# EAGLE design aparture_v1_controller (EAGLE 6.3)
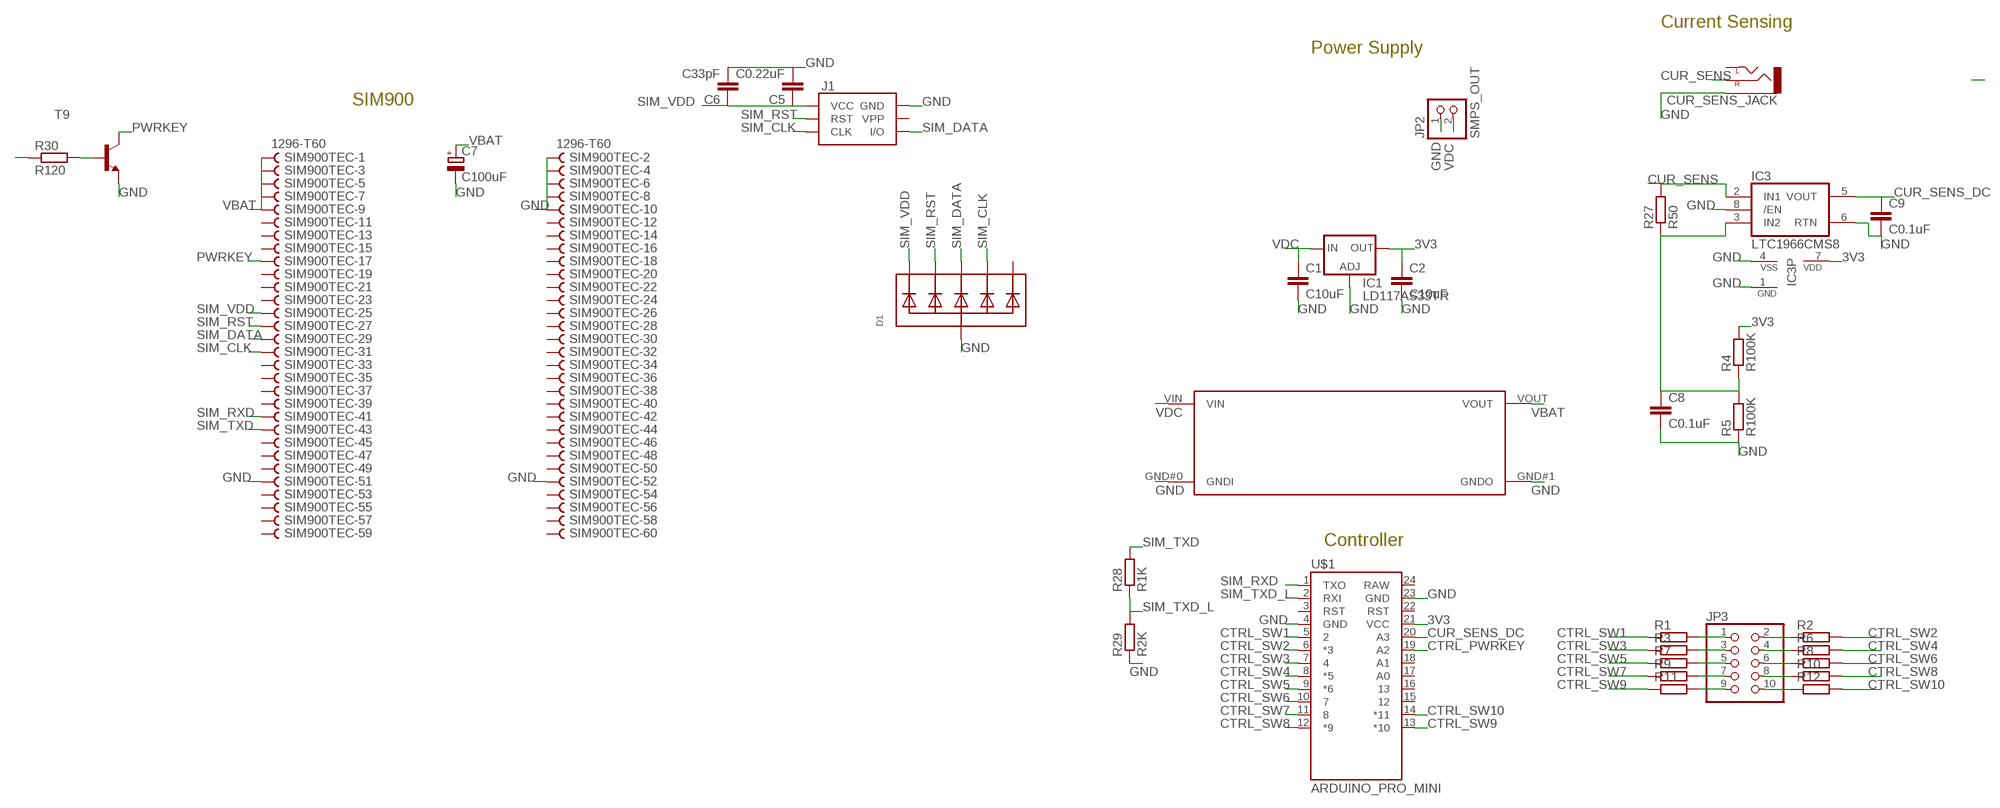
[diagram p0: schematic, sheet 1]

## Parts
C1  C10uF  C-EUC0805  [C0805]
C2  C10uF  C-EUC0805  [C0805]
C5  C0.22uF  C-EUC0805  [C0805]
C6  C33pF  C-EUC0805  [C0805]
C7  C100uF  CPOL-EU153CLV-0605  [153CLV-0605]
C8  C0.1uF  C-EUC0805  [C0805]
C9  C0.1uF  C-EUC0805  [C0805]
CUR_SENS_JACK  AUDIO-JACKSMD2  [AUDIO-JACK-3.5MM-SMD]
D1  TVSARRAY_5LANE  [SOT363]
IC1  LD117AS33TR  [SOT223]
IC3  LTC1966CMS8  [MSOP8]
J1  SIMHOLDERSIM  [SIMHOLDER]
JP2  SMPS_OUT  PINHD-1X2  [1X02]
JP3  PINHD-2X5  [2X05]
R1  R-EU_R0603  [R0603]
R2  R-EU_R0603  [R0603]
R3  R-EU_R0603  [R0603]
R4  R100K  R-EU_M0805  [M0805]
R5  R100K  R-EU_M0805  [M0805]
R6  R-EU_R0603  [R0603]
R7  R-EU_R0603  [R0603]
R8  R-EU_R0603  [R0603]
R9  R-EU_R0603  [R0603]
R10  R-EU_R0603  [R0603]
R11  R-EU_R0603  [R0603]
R12  R-EU_R0603  [R0603]
R27  R50  R-EU_M0805  [M0805]
R28  R1K  R-EU_M0805  [M0805]
R29  R2K  R-EU_M0805  [M0805]
R30  R120  R-EU_M0805  [M0805]
SIM900TEC  1296-T60  [1296-60]
T9  MMBT2222ALT1-NPN-SOT23-BEC  [SOT23-BEC]
U$1  ARDUINO_PRO_MINI  [ARDUINO_PRO_MINI]
VOL_REG_SIM900  DCDCMODULE  [DCDCMODULE]

## Nets
3V3: C2.1 IC1.4(OUT) IC3.7(VDD) R4.2 U$1.21(VCC)
CTRL_PWRKEY: R30.1 U$1.19(A2)
CTRL_SW1: R1.1 U$1.5
CTRL_SW2: R2.2 U$1.6(*3)
CTRL_SW3: R3.1 U$1.7
CTRL_SW4: R6.2 U$1.8(*5)
CTRL_SW5: R7.1 U$1.9(*6)
CTRL_SW6: R8.2 U$1.10
CTRL_SW7: R9.1 U$1.11
CTRL_SW8: R10.2 U$1.12(*9)
CTRL_SW9: R11.1 U$1.13(*10)
CTRL_SW10: R12.2 U$1.14(*11)
CUR_SENS: CUR_SENS_JACK.RING(RIGHT) IC3.2(IN1) R27.2
CUR_SENS_DC: C9.1 IC3.5(VOUT) U$1.20(A3)
GND: C1.2 C2.2 C5.2 C6.2 C7.- C8.2 C9.2 CUR_SENS_JACK.SLEEVE D1.2(A) IC1.1(ADJ) IC3.1(GND) IC3.4(VSS) IC3.6(RTN) IC3.8(/EN) J1.C5(GND) JP2.1 R5.1 R29.1 SIM900TEC.2 SIM900TEC.4 SIM900TEC.6 SIM900TEC.8 SIM900TEC.10 SIM900TEC.51 SIM900TEC.52 T9.E U$1.4(GND) U$1.23(GND) VOL_REG_SIM900.GND#0(GNDI) VOL_REG_SIM900.GND#1(GNDO)
N$1: JP3.1 R1.2
N$2: JP3.3 R3.2
N$3: JP3.5 R7.2
N$4: JP3.7 R9.2
N$5: JP3.9 R11.2
N$6: JP3.2 R2.1
N$7: C8.1 IC3.3(IN2) R4.1 R5.2 R27.1
N$8: R30.2 T9.B
N$9: JP3.4 R6.1
N$10: JP3.6 R8.1
N$11: JP3.8 R10.1
N$12: JP3.10 R12.1
PWRKEY: SIM900TEC.17 T9.C
SIM_CLK: D1.5(C4) J1.C3(CLK) SIM900TEC.31
SIM_DATA: D1.4(C3) J1.C7(I/O) SIM900TEC.29
SIM_RST: D1.3(C2) J1.C2(RST) SIM900TEC.27
SIM_RXD: SIM900TEC.41 U$1.1(TXO)
SIM_TXD: R28.2 SIM900TEC.43
SIM_TXD_L: R28.1 R29.2 U$1.2(RXI)
SIM_VDD: C5.1 C6.1 D1.1(C1) J1.C1(VCC) SIM900TEC.25
VBAT: C7.+ SIM900TEC.1 SIM900TEC.3 SIM900TEC.5 SIM900TEC.7 SIM900TEC.9 VOL_REG_SIM900.VOUT
VDC: C1.1 IC1.3(IN) JP2.2 VOL_REG_SIM900.VIN
Unconnected: CUR_SENS_JACK.TIP(LEFT) D1.6(C5) J1.C6(VPP) SIM900TEC.11 SIM900TEC.12 SIM900TEC.13 SIM900TEC.14 SIM900TEC.15 SIM900TEC.16 SIM900TEC.18 SIM900TEC.19 SIM900TEC.20 SIM900TEC.21 SIM900TEC.22 SIM900TEC.23 SIM900TEC.24 SIM900TEC.26 SIM900TEC.28 SIM900TEC.30 SIM900TEC.32 SIM900TEC.33 SIM900TEC.34 SIM900TEC.35 SIM900TEC.36 SIM900TEC.37 SIM900TEC.38 SIM900TEC.39 SIM900TEC.40 SIM900TEC.42 SIM900TEC.44 SIM900TEC.45 SIM900TEC.46 SIM900TEC.47 SIM900TEC.48 SIM900TEC.49 SIM900TEC.50 SIM900TEC.53 SIM900TEC.54 SIM900TEC.55 SIM900TEC.56 SIM900TEC.57 SIM900TEC.58 SIM900TEC.59 SIM900TEC.60 U$1.3(RST) U$1.15 U$1.16 U$1.17(A0) U$1.18(A1) U$1.22(RST) U$1.24(RAW)

## Notes on the sheet
- Current Sensing
- Power Supply
- SIM900
- Controller

## Library data of the parts
C1 C2 C5 C6 C8 C9 = resistor:C-EU: CAPACITOR, European symbol
C7 = resistor:CPOL-EU: POLARIZED CAPACITOR, European symbol
CUR_SENS_JACK = SparkFun-Connectors:AUDIO-JACK: 3.5mm Audio Jack Simple 3.5mm common PCB mount audio jack. SKU: PRT-08032; PROD_ID: CONN-10353
D1 = microbuilder:TVSARRAY_5LANE: Voltage Transient Suppressor Array SOT363 SMF05C - 100W 5V: Digikey - SMF05CT1GOSCT-ND
IC1 = v-reg:LD117A?*: Low drop fixed and adjustable positive voltage regulators 1 A Source: http://www.st.com/stonline/products/literature/ds/7194/ld1117axx.pdf
IC3 = linear-technology-2:LTC1966*: Precision Micropower, DS RMS-to-DC Converter
J1 = SparkFun-Connectors:SIMHOLDER: SIM Socket Socket for SIM cellular cards. Schematic element and footprint production proven. Spark Fun Electronics SKU : PRT-00548; PROD_ID: CONN-08536
JP2 = pinhead:PINHD-1X2: PIN HEADER
JP3 = pinhead:PINHD-2X5: PIN HEADER
R1-R3 R6-R12 = rcl:R-EU_: RESISTOR, European symbol
R4 R5 R27-R30 = resistor:R-EU_: RESISTOR, European symbol
SIM900TEC = con-leotronics:1296-T60: 1.27mm SINGLE ROW FEMALE SOCKET Source: http://www.leotronics.co.uk/Conexcon/Data%20Sheets/sec.%20A/1296ing.pdf; OC_FARNELL: unknown; OC_NEWARK: unknown
T9 = transistor-neu-to92:*-NPN-: NPN Transistror
U$1 = tigorcustom:ARDUINO_PRO_MINI
VOL_REG_SIM900 = bontor:DCDCMODULE

## Board
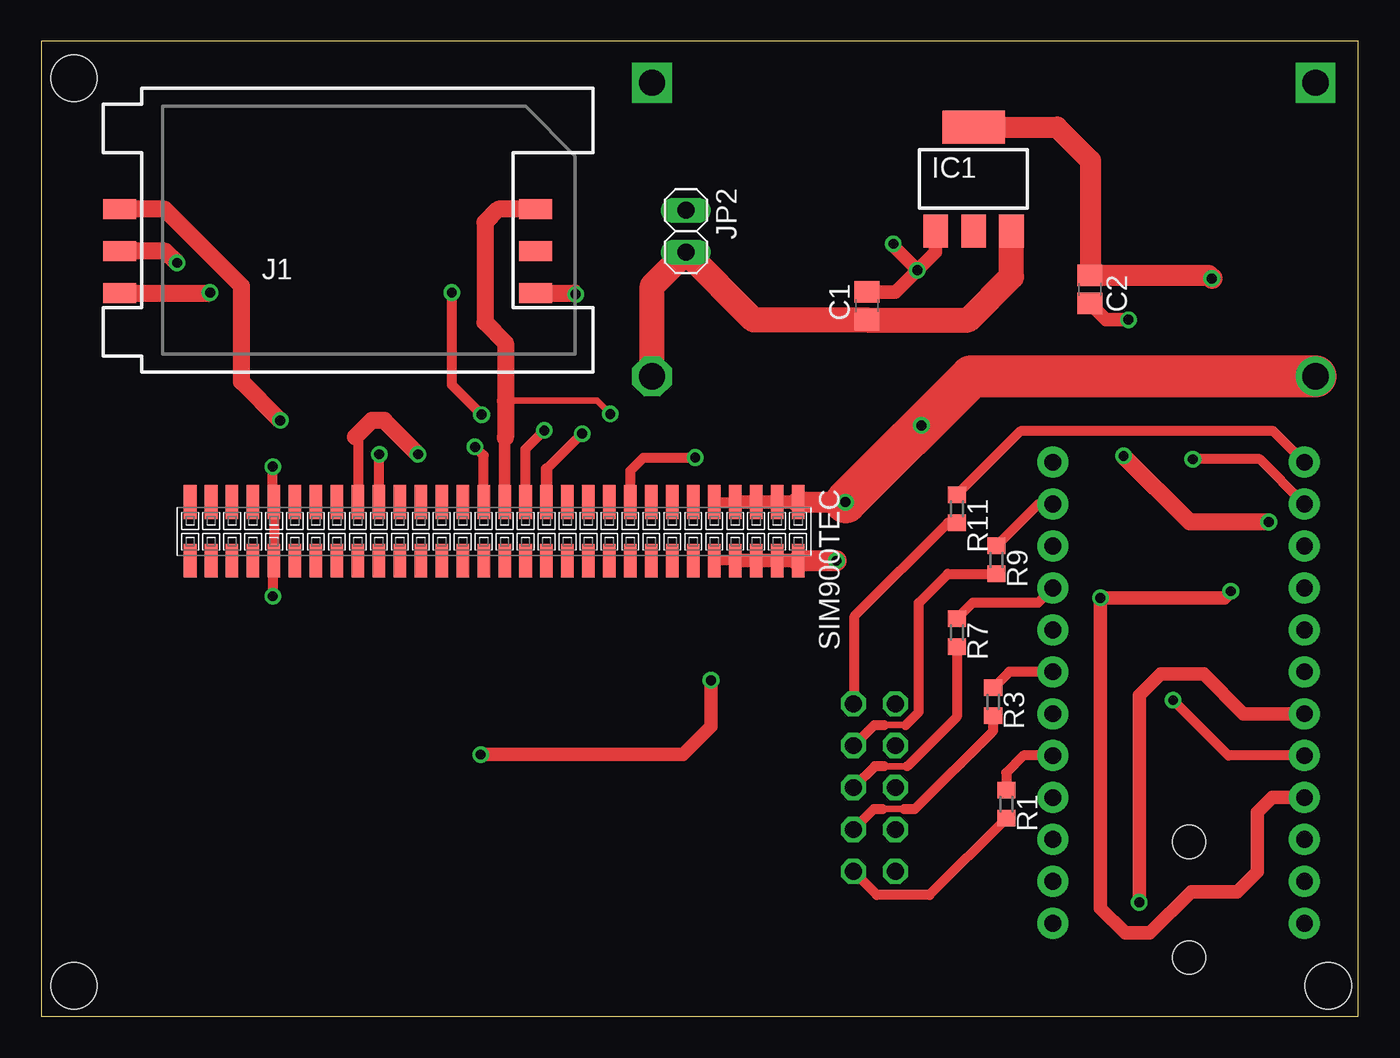
[diagram p1: board, top side]
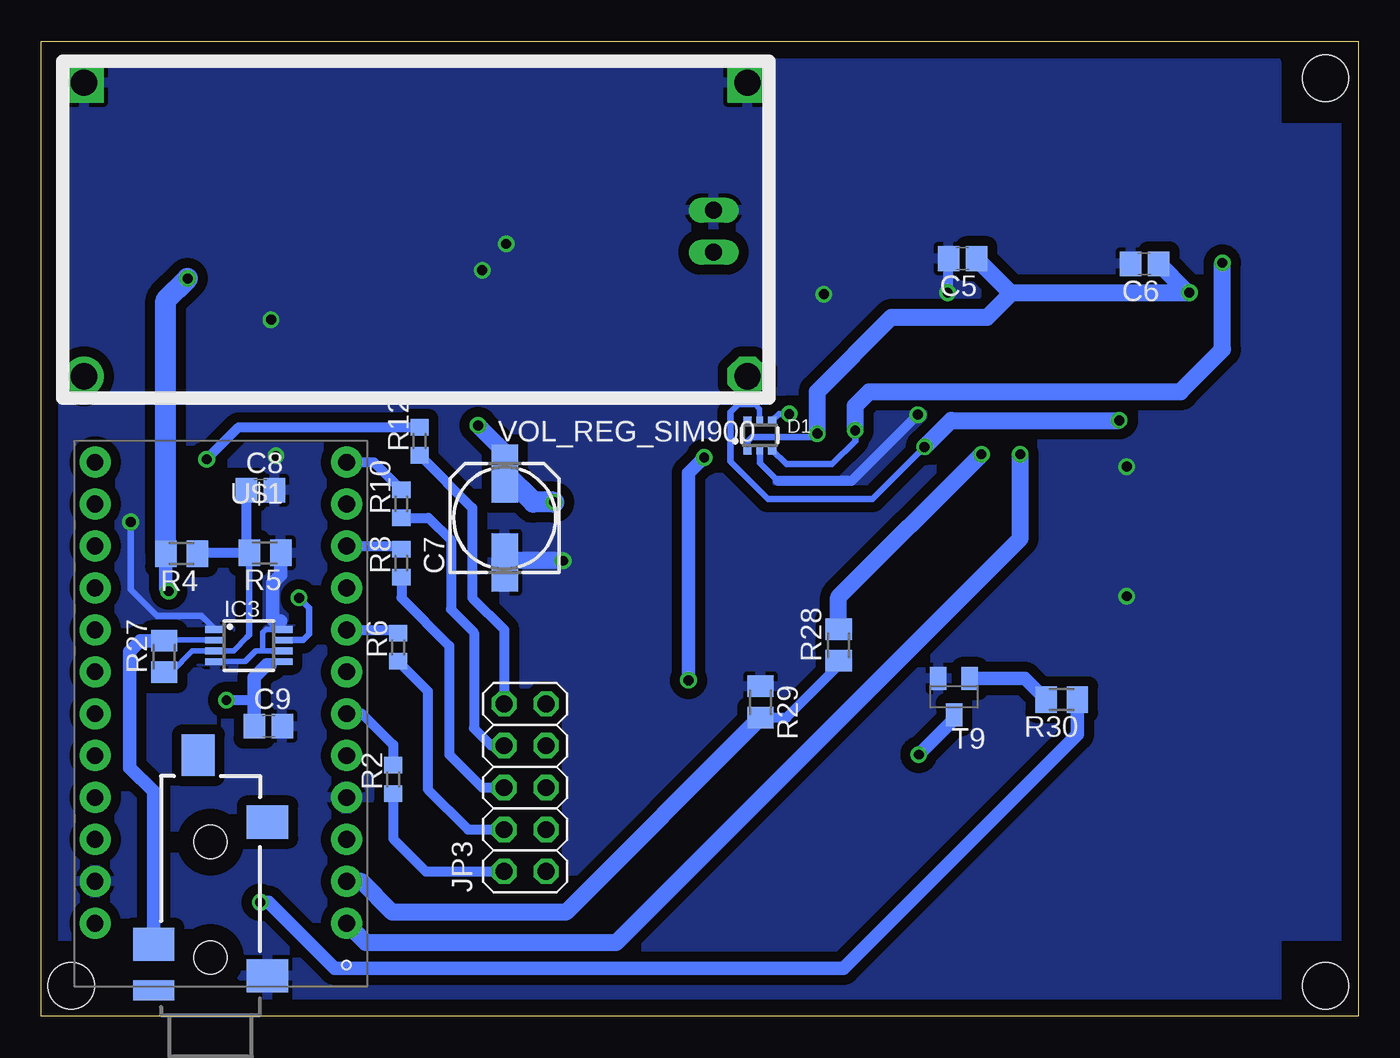
[diagram p2: board, bottom side, seen from below]

Size 79.8 x 59.1 mm. Coordinates in mm from the lower left corner, seen from the top.
Outline: 0,0 79.8,0 79.8,59.1 0,59.1 0,0
Copper layers (1*16): Top 0.035mm / dielectric 1.5mm / Bottom 0.035mm
Design rules "default": minimum track width 10mil, minimum drill 24mil, track to track 8mil, track to pad 8mil, pad to pad 8mil, via to via 8mil, smd to smd 8mil, copper to edge 40mil, drill to drill 8mil, minimum pad ring 10mil, minimum via ring 8mil, stop-mask expansion 4mil, vias tented up to drill 0mil, thermal gap 10mil
Holes 2.8 mm at 1.98,56.87 1.98,1.87 77.98,1.87

### Footprints (pad centres in the part's own frame; a part is rotated, then mirrored left to right if it is on the bottom)
C0805 = smd 1.3 x 1.5: 1 -0.85,0; 2 0.85,0
153CLV-0605 = smd 3.5 x 1.6: + 2.7,0; - -2.7,0
AUDIO-JACK-3.5MM-SMD = smd 2 x 2.5: RING 4.3,3.45; SLEEVE 2.4,-3.45; TIP 11.7,-3.45 | smd 1.2 x 2.5: RSH 1.5,3.45 | smd 2.5 x 2: TSH 15.75,0.75 | hole 2: 3.5,0; 10.5,0
SOT363 = smd 0.5 x 0.5: 1 -0.75,-0.9; 3 0.75,-0.9; 4 0.75,0.9; 6 -0.75,0.9 | smd 0.4 x 0.5: 2 0,-0.9; 5 0,0.9
SOT223 = smd 1.5 x 2: 1 -2.3,-3.15; 2 0,-3.15; 3 2.3,-3.15 | smd 3.8 x 2: 4 0,3.15
MSOP8 = smd 0.4 x 1.2: 1 -0.975,-2.05; 2 -0.325,-2.05; 3 0.325,-2.05; 4 0.975,-2.05; 5 0.975,2.05; 6 0.325,2.05; 7 -0.325,2.05; 8 -0.975,2.05
SIMHOLDER = smd 2 x 1.2: C1 -12.61,-3.81; C2 -12.61,-1.27; C3 -12.61,1.27; C5 12.61,-3.81; C6 12.61,-1.27; C7 12.61,1.27
1X02 = drill 1.016 long: 1 -1.27,0; 2 1.27,0
2X05 = drill 1.016 octagon: 1 -5.08,-1.27; 2 -5.08,1.27; 3 -2.54,-1.27; 4 -2.54,1.27; 5 0,-1.27; 6 0,1.27; 7 2.54,-1.27; 8 2.54,1.27; 9 5.08,-1.27; 10 5.08,1.27
R0603 = smd 1 x 1.1: 1 -0.85,0; 2 0.85,0
M0805 = smd 1.3 x 1.6: 1 -0.95,0; 2 0.95,0
1296-60 = smd 0.76 x 2.05: 1 -18.415,-1.78; 2 -18.415,1.78; 3 -17.145,-1.78; 4 -17.145,1.78; 5 -15.875,-1.78; 6 -15.875,1.78; 7 -14.605,-1.78; 8 -14.605,1.78; 9 -13.335,-1.78; 10 -13.335,1.78; 11 -12.065,-1.78; 12 -12.065,1.78; 13 -10.795,-1.78; 14 -10.795,1.78; 15 -9.525,-1.78; 16 -9.525,1.78; 17 -8.255,-1.78; 18 -8.255,1.78; 19 -6.985,-1.78; 20 -6.985,1.78; 21 -5.715,-1.78; 22 -5.715,1.78; 23 -4.445,-1.78; 24 -4.445,1.78; 25 -3.175,-1.78; 26 -3.175,1.78; 27 -1.905,-1.78; 28 -1.905,1.78; 29 -0.635,-1.78; 30 -0.635,1.78; 31 0.635,-1.78; 32 0.635,1.78; 33 1.905,-1.78; 34 1.905,1.78; 35 3.175,-1.78; 36 3.175,1.78; 37 4.445,-1.78; 38 4.445,1.78; 39 5.715,-1.78; 40 5.715,1.78; 41 6.985,-1.78; 42 6.985,1.78; 43 8.255,-1.78; 44 8.255,1.78; 45 9.525,-1.78; 46 9.525,1.78; 47 10.795,-1.78; 48 10.795,1.78; 49 12.065,-1.78; 50 12.065,1.78; 51 13.335,-1.78; 52 13.335,1.78; 53 14.605,-1.78; 54 14.605,1.78; 55 15.875,-1.78; 56 15.875,1.78; 57 17.145,-1.78; 58 17.145,1.78; 59 18.415,-1.78; 60 18.415,1.78
SOT23-BEC = smd 1 x 1.4: B -0.95,-1.1; C 0,1.1; E 0.95,-1.1
ARDUINO_PRO_MINI = drill 1.016 pad 1.88: 1 -7.62,12.7; 2 -7.62,10.16; 3 -7.62,7.62; 4 -7.62,5.08; 5 -7.62,2.54; 6 -7.62,0; 7 -7.62,-2.54; 8 -7.62,-5.08; 9 -7.62,-7.62; 10 -7.62,-10.16; 11 -7.62,-12.7; 12 -7.62,-15.24; 13 7.62,-15.24; 14 7.62,-12.7; 15 7.62,-10.16; 16 7.62,-7.62; 17 7.62,-5.08; 18 7.62,-2.54; 19 7.62,0; 20 7.62,2.54; 21 7.62,5.08; 22 7.62,7.62; 23 7.62,10.16; 24 7.62,12.7
DCDCMODULE = drill 1.6 square: GND#0 1.7,1.7; GND#1 41.9,1.7 | drill 1.6 octagon: VIN 1.7,19.5 | drill 1.6: VOUT 41.9,19.5

### Placement (x,y rotation side)
C1  50.03,43.06 90 top
C2  63.53,44.06 270 top
C5  23.98,45.92 180 bottom
C6  12.94,45.61 180 bottom
C7  51.72,30.21 90 bottom
C8  66.52,31.89 0 bottom
C9  66.04,17.59 0 bottom
CUR_SENS_JACK  69.54,0.08 90 bottom
D1  36.26,35.22 0 bottom
IC1  56.49,50.75 0 top
IC3  67.22,22.48 270 bottom
J1  17.35,47.65 0 top
JP2  39.06,47.59 270 top
JP3  50.48,13.87 90 bottom
R1  58.48,12.87 270 top
R2  58.48,14.37 90 bottom
R3  57.68,19.07 270 top
R4  71.3,28.05 180 bottom
R5  66.24,28.1 180 bottom
R6  58.18,22.37 90 bottom
R7  55.48,23.27 270 top
R8  57.98,27.47 90 bottom
R9  57.88,27.67 270 top
R10  57.98,31.07 90 bottom
R11  55.48,30.77 270 top
R12  56.88,34.87 90 bottom
R27  72.35,21.81 90 bottom
R28  31.49,22.51 90 bottom
R29  36.22,19.06 270 bottom
R30  17.97,19.21 180 bottom
SIM900TEC  27.44,29.4 180 top
T9  24.49,19.38 180 bottom
U$1  68.92,18.35 180 bottom
VOL_REG_SIM900  35.31,58.29 180 bottom

### Tracks (layer width: path | path; a pad name or v marks a point on that pad's centre or on a via)
3V3  (via drill 0.6)
  Top 0.813: U$1.21 74.58,13.27 73.68,12.37 73.68,8.77 72.48,7.57 69.68,7.57 67.18,5.07 65.68,5.07 64.18,6.57 v64.18,25.37 71.68,25.37 v72.08,25.77
  Top 1.27: v70.93,44.72 70.74,44.91 C2.1 63.58,44.96 63.58,51.87 61.55,53.9 IC1.4
  Bottom 0.406: IC3.7 63.95,22.8 63.58,23.17 63.58,24.77 v64.18,25.37
  Bottom 0.813: v72.08,25.77 72.25,25.94 R4.2
  Bottom 1.27: R4.2 72.25,43.4 v70.93,44.72
CTRL_PWRKEY  (via drill 0.6)
  Top 0.813: v66.53,6.92 66.53,19.47 67.83,20.77 70.43,20.77 72.85,18.35 U$1.19
  Bottom 0.813: R30.1 17.02,17.08 31.18,2.92 62.03,2.92 66.03,6.92 v66.53,6.92
CTRL_SW1
  Top 0.61: U$1.5 59.52,15.81 58.48,14.77 R1.1
CTRL_SW2
  Bottom 0.61: U$1.6 60.36,18.35 58.48,16.47 R2.2
CTRL_SW3
  Top 0.61: U$1.7 58.65,20.89 R3.1
CTRL_SW4
  Bottom 0.61: U$1.8 58.39,23.43 R6.2
CTRL_SW5
  Top 0.61: U$1.9 60.4,25.07 56.43,25.07 R7.1
CTRL_SW6
  Bottom 0.61: U$1.10 58.17,28.51 R8.2
CTRL_SW7
  Top 0.61: U$1.11 60.41,31.05 R9.1
CTRL_SW8
  Bottom 0.61: U$1.12 59.65,33.59 R10.2
CTRL_SW9
  Top 0.61: U$1.13 74.66,35.47 59.33,35.47 R11.1
CTRL_SW10  (via drill 0.6)
  Top 0.61: U$1.14 73.82,33.77 v69.78,33.77
  Bottom 0.61: v69.78,33.77 67.83,35.72 R12.2
CUR_SENS
  Bottom 0.34: IC3.2 69.29,22.82 72.29,22.82 R27.2
  Bottom 0.813: R27.2 73.79,22.76 74.43,22.12 74.43,15.07 72.99,13.63 CUR_SENS_JACK.RING
CUR_SENS_DC  (via drill 0.6)
  Top 0.61: U$1.20 71.94,15.81 v68.58,19.17
  Bottom 0.34: 65.93,21.32 65.75,21.51 IC3.5
  Bottom 0.61: v68.58,19.17 66.94,19.17 66.89,19.12
  Bottom 0.813: C9.1 66.89,19.12 66.89,20.56 66.13,21.32 65.93,21.32
GND  (via drill 0.6)
  Top 0.61: SIM900TEC.8 SIM900TEC.10 | v14.03,33.32 14.03,31.26 SIM900TEC.51 SIM900TEC.52 14.03,27.55 v14.03,25.47 | v26.68,36.47 24.88,38.27 v24.88,43.87
  Top 0.813: SIM900TEC.2 SIM900TEC.4 SIM900TEC.6 SIM900TEC.8 | IC1.1 54.19,46.33 v53.08,45.22 | C1.2 51.77,43.91 v53.08,45.22 | v51.63,46.82 51.63,46.67 v53.08,45.22 | v65.88,42.22 64.52,42.22 C2.2
  Top 1.016: J1.C5 32.31,43.84 v32.38,43.77 | v74.38,29.97 69.58,29.97 v65.58,33.97
  Top 1.27: SIM900TEC.2 v48.18,27.62
  Bottom 0.33: 65.28,23.97 65.17,23.86 IC3.8
  Bottom 0.34: IC3.4 67.45,21.51 66.8,22.16 66.38,22.16 | 66.38,22.16 IC3.6 | IC3.8 65.19,23.47 66.18,23.47 66.38,23.27 66.38,22.16
  Bottom 0.406: D1.2 36.26,33.55 35.18,32.47 | IC3.1 70.09,24.27 72.78,24.27 74.38,25.87 v74.38,29.97
  Bottom 0.61: 35.18,32.47 30.68,32.47 v26.68,36.47 | v24.88,43.87 24.83,43.92 C5.2
  Bottom 0.813: R5.1 65.29,26.76 65.78,26.27 65.78,24.07 65.68,23.97 65.28,23.97
  Bottom 1.016: v48.18,27.62 51.61,27.62 C7.-
  pour Bottom (isolate 0.61): 0.98,4.87 4.98,4.87 4.98,0.87 74.98,0.87 74.98,4.87 78.98,4.87 78.98,57.87 4.98,57.87 4.98,53.87 0.98,53.87
N$1
  Top 0.61: R1.2 53.83,7.37 50.63,7.37 JP3.1
N$2
  Top 0.406: 50.98,12.57 52.28,12.57
  Top 0.61: 50.98,12.57 50.45,12.57 JP3.3 | 52.28,12.57 52.93,12.57 57.68,17.32 R3.2
N$3
  Top 0.406: 52.48,15.17 51.08,15.17
  Top 0.61: R7.2 55.48,18.17 52.48,15.17 | 51.08,15.17 50.51,15.17 JP3.5
N$4
  Top 0.406: 51.08,17.67 52.38,17.67
  Top 0.61: JP3.7 50.47,17.67 51.08,17.67 | R9.2 54.93,26.82 53.18,25.07 53.18,18.47 52.38,17.67
N$5
  Top 0.61: R11.2 54.93,29.92 49.28,24.27 49.28,19.02 JP3.9
N$6
  Bottom 0.61: R2.1 58.48,10.77 56.5,8.79 JP3.2
N$7
  Bottom 0.34: R27.1 71.94,20.86 70.65,22.16 IC3.3 68.15,22.16 67.28,23.02
  Bottom 0.406: 67.28,23.02 67.19,23.11 R5.2
  Bottom 0.61: R4.1 70.3,28.1 R5.2 67.37,28.28 C8.1
N$8
  Bottom 0.813: R30.2 20.19,20.48 T9.B
N$9
  Bottom 0.61: R6.1 56.38,19.72 56.38,13.77 53.94,11.33 JP3.4
N$10
  Bottom 0.61: R8.1 57.98,25.37 55.08,22.47 55.08,15.87 53.08,13.87 JP3.6
N$11
  Bottom 0.61: R10.1 56.33,30.22 54.98,28.87 54.98,24.67 53.58,23.27 53.58,17.47 52.52,16.41 JP3.8
N$12
  Bottom 0.61: R12.1 53.68,30.82 53.68,25.37 51.75,23.44 JP3.10
PWRKEY  (via drill 0.6)
  Top 0.61: SIM900TEC.17 35.7,33.09 36.48,33.87 v39.63,33.87
  Top 0.813: v26.63,15.87 38.88,15.87 40.58,17.57 v40.58,20.37
  Bottom 0.813: v39.63,33.87 40.58,32.92 v40.58,20.37 | v26.63,15.87 24.49,18.01 T9.C
SIM_CLK  (via drill 0.6)
  Top 0.61: SIM900TEC.31 26.8,33.99 v26.28,34.52
  Top 1.016: v14.48,36.12 12.13,38.47 12.13,44.27 7.48,48.92 J1.C3
  Bottom 0.34: D1.5 36.28,36.14 36.28,36.82 36.53,37.07 37.58,37.07
  Bottom 0.406: 37.58,37.07 38.03,36.62 38.03,33.62 35.78,31.37 29.43,31.37 v26.28,34.52
  Bottom 1.016: v26.28,34.52 24.68,36.12 v14.48,36.12
SIM_DATA  (via drill 0.6)
  Top 0.406: v34.48,36.52 33.68,37.32 28.13,37.32
  Top 0.7: SIM900TEC.29 28.07,35.06 28.13,35.12
  Top 1.016: J1.C7 27.68,48.92 26.88,48.12 26.88,42.07 28.13,40.82 28.13,37.32 28.13,35.12 28.13,35.07
  Bottom 0.406: D1.4 35.11,36.52 v34.48,36.52
SIM_RST  (via drill 0.6)
  Top 0.61: SIM900TEC.27 29.34,34.38 v30.48,35.52
  Top 1.016: v8.23,45.67 7.52,46.38 J1.C2
  Bottom 0.406: v30.48,35.52 30.48,34.87 31.88,33.47 34.66,33.47 D1.3
  Bottom 1.016: v30.48,35.52 30.48,37.02 29.63,37.87 10.78,37.87 8.23,40.42 v8.23,45.67
SIM_RXD  (via drill 0.6)
  Top 0.61: v20.48,34.07 20.46,34.04 SIM900TEC.41
  Bottom 1.016: v20.48,34.07 20.48,28.97 44.98,4.47 60.12,4.47 U$1.1
SIM_TXD  (via drill 0.6)
  Top 0.61: 19.03,35.12 19.18,34.96 SIM900TEC.43
  Top 1.016: v22.83,34.07 20.78,36.12 20.03,36.12 19.03,35.12
  Bottom 1.016: R28.2 31.49,25.41 v22.83,34.07
SIM_TXD_L
  Bottom 0.61: R29.2 34.64,18.11 31.49,21.26 R28.1
  Bottom 1.016: R29.2 48.01,6.32 58.53,6.32 60.4,8.19 U$1.2
SIM_VDD  (via drill 0.6)
  Top 0.61: 30.63,33.17 v32.78,35.32
  Top 0.7: SIM900TEC.25 30.63,31.2 30.63,33.17
  Top 1.016: J1.C1 10.2,43.84 v10.23,43.87
  Bottom 0.406: v32.78,35.32 32.98,35.12 36.73,35.12 37.01,34.84 D1.1
  Bottom 1.016: C6.1 10.35,43.87 v10.23,43.87 21.08,43.87 | C5.1 21.08,43.87 | v32.78,35.32 32.78,37.87 28.28,42.37 22.48,42.37 21.08,43.77 21.08,43.87
VBAT  (via drill 0.6)
  Top 0.61: SIM900TEC.9 SIM900TEC.7
  Top 0.813: SIM900TEC.7 SIM900TEC.5 SIM900TEC.3 SIM900TEC.1
  Top 1.27: SIM900TEC.1 v48.73,31.17
  Top 2.54: VOL_REG_SIM900.VOUT 56.35,38.79 v48.73,31.17
  Bottom 1.016: v53.33,35.82 51.72,34.21 C7.+
  Bottom 1.27: v48.73,31.17 49.98,31.17 C7.+
VDC
  Top 1.5: VOL_REG_SIM900.VIN 37.01,44.27 JP2.2 43.17,42.21 C1.1 56.17,42.21 58.79,44.83 IC1.3